# Altium schematic sheet TestPCB_2561.SchDoc: Datalogger
size A4; Date: 12-1-2023; Author: Jesse Wijermars; CompanyName: Blue Racing team; DrawnBy: Jesse Wijermars; Revision: 1; SheetNumber: 1; SheetTotal: 1
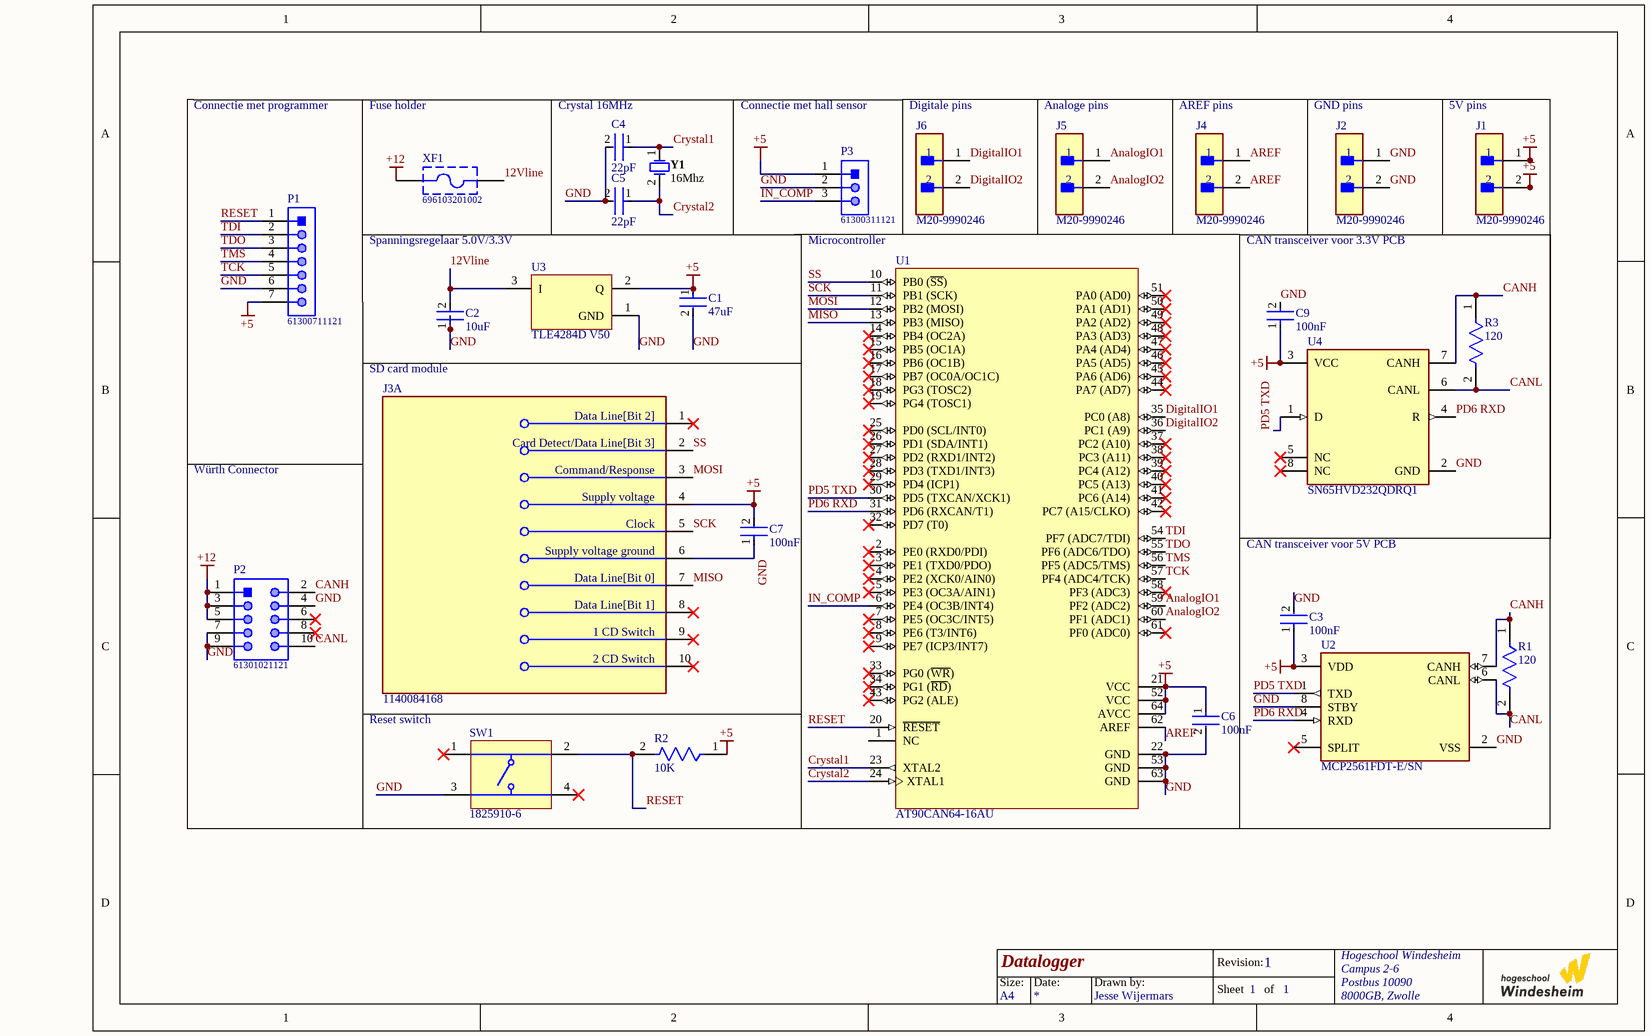
[diagram p0: TestPCB_2561.SchDoc]

## Parts
C1  47uF  [FP-CC1206-1_25-MFG]
C2  10uF  [FP-CC1206-1_25-MFG]
C3  100nF  [FP-CC1206-1_25-MFG]
C4  22pF  [FP-CC1206-1_25-MFG]
C5  22pF  [FP-CC1206-1_25-MFG]
C6  100nF  [FP-CC1206-1_25-MFG]
C7  100nF  [FP-CC1206-1_25-MFG]
C9  100nF  [FP-CC1206-1_25-MFG]
J1  M20-9990246  [FP-M20-9990246-MFG]
J2  M20-9990246  [FP-M20-9990246-MFG]
J3  1140084168  [FP-1140084168-0]  (part A of 2)
J4  M20-9990246  [FP-M20-9990246-MFG]
J5  M20-9990246  [FP-M20-9990246-MFG]
J6  M20-9990246  [FP-M20-9990246-MFG]
P1  61300711121  [61300711121]
P2  61301021121  [61301021121]
P3  61300311121  [61300311121]
R1  120  [FP-CRCW1206-e3-IPC_C]
R2  10K  [FP-CRCW1206-e3-IPC_C]
R3  120  [FP-CRCW1206-e3-IPC_C]
SW1  1825910-6  [TECO-1825910-6_V]
U1  AT90CAN64-16AU  [64A_M]
U2  MCP2561FDT-E/SN  [FP-C04-057-SN-MFG]
U3  TLE4284D V50  [INF-PG-TO252-3-11_M]
U4  SN65HVD232QDRQ1  [FP-D0008A-MFG]
XF1  696103201002  [696103201002]
Y1  16Mhz  [FOX-FOXSLF160-20]

## Nets
+5: C1.1 C3.1 C6.1 C7.2 C9.1 J1.1 J1.2 J3.4(Supply_voltage) P1.7 P3.1 R2.1 U1.21(VCC) U1.52(VCC) U1.64(AVCC) U2.3(VDD) U3.2(Q) U4.3(VCC)
+12: P2.1 P2.3 P2.5 XF1.1
12Vline: C2.2 U3.3(I) XF1.2
AnalogIO1: J5.1 U1.59(PF2_(ADC2))
AnalogIO2: J5.2 U1.60(PF1_(ADC1))
AREF: J4.1 J4.2 U1.62(AREF)
CANH: P2.2 R1.1 R3.1 U2.7(CANH) U4.7(CANH)
CANL: P2.10 R1.2 R3.2 U2.6(CANL) U4.6(CANL)
Crystal1: C4.1 U1.23(XTAL2) Y1.1
Crystal2: C5.1 U1.24(XTAL1) Y1.2
DigitalIO1: J6.1 U1.35(PC0_(A8))
DigitalIO2: J6.2 U1.36(PC1_(A9))
GND: C1.2 C2.1 C3.2 C4.2 C5.2 C6.2 C7.1 C9.2 J2.1 J2.2 J3.6(Supply_voltage_ground) P1.6 P2.4 P2.7 P2.9 P3.2 SW1.3 U1.22(GND) U1.53(GND) U1.63(GND) U2.2(VSS) U2.8(STBY) U3.1(GND) U4.2(GND)
IN_COMP: P3.3 U1.6(PE4_(OC3B/INT4))
MISO: J3.7(Data_Line[Bit_0]) U1.13(PB3_(MISO))
MOSI: J3.3(Command/Response) U1.12(PB2_(MOSI))
PD5 TXD: U1.30(PD5_(TXCAN/XCK1)) U2.1(TXD) U4.1(D)
PD6 RXD: U1.31(PD6_(RXCAN/T1)) U2.4(RXD) U4.4(R)
RESET: P1.1 R2.2 SW1.2 U1.20(~{RESET})
SCK: J3.5(Clock) U1.11(PB1_(SCK))
SS: J3.2(Card_Detect/Data_Line[Bit_3]) U1.10(PB0_(~{SS}))
TCK: P1.5 U1.57(PF4_(ADC4/TCK))
TDI: P1.2 U1.54(PF7_(ADC7/TDI))
TDO: P1.3 U1.55(PF6_(ADC6/TDO))
TMS: P1.4 U1.56(PF5_(ADC5/TMS))

Not connected (* = marked no-connect by the designer): J3 1(Data_Line[Bit_2])* 8(Data_Line[Bit_1])* 9(1_CD_Switch)* 10(2_CD_Switch)*; P2 6* 8*; SW1 1* 4*; U1 1(NC) 2(PE0_(RXD0/PDI))* 3(PE1_(TXD0/PDO))* 4(PE2_(XCK0/AIN0))* 5(PE3_(OC3A/AIN1))* 7(PE5_(OC3C/INT5))* 8(PE6_(T3/INT6))* 9(PE7_(ICP3/INT7))* 14(PB4_(OC2A))* 15(PB5_(OC1A))* 16(PB6_(OC1B))* 17(PB7_(OC0A/OC1C))* 18(PG3_(TOSC2))* 19(PG4_(TOSC1))* 25(PD0_(SCL/INT0))* 26(PD1_(SDA/INT1))* 27(PD2_(RXD1/INT2))* 28(PD3_(TXD1/INT3))* 29(PD4_(ICP1))* 32(PD7_(T0))* 33(PG0_(~{WR}))* 34(PG1_(~{RD}))* 37(PC2_(A10))* 38(PC3_(A11))* 39(PC4_(A12))* 40(PC5_(A13))* 41(PC6_(A14))* 42(PC7_(A15/CLKO))* 43(PG2_(ALE))* 44(PA7_(AD7))* 45(PA6_(AD6))* 46(PA5_(AD5))* 47(PA4_(AD4))* 48(PA3_(AD3))* 49(PA2_(AD2))* 50(PA1_(AD1))* 51(PA0_(AD0))* 58(PF3_(ADC3))* 61(PF0_(ADC0))*; U2 5(SPLIT)*; U4 5(NC)* 8(NC)*

## Notes on the sheet
- Connectie met programmer
- Fuse holder
- Crystal 16MHz
- Connectie met hall sensor
- (near J6) Digitale pins
- (near J5) Analoge pins
- (near J4) AREF pins
- (near J2) GND pins
- (near J1) 5V pins
- Spanningsregelaar 5.0V/3.3V
- Microcontroller
- CAN transceiver voor 3.3V PCB
- (near C2) SD card module
- Würth Connector
- CAN transceiver voor 5V PCB
- (near SW1) Reset switch
- Size:
- Date:
- Drawn by:
- Revision:
- Hogeschool Windesheim
- Campus 2-6
- Postbus 10090
- A4
- Sheet
- of
- 8000GB, Zwolle

## Library data of the parts
C1 C2 C4 C5 = CMP-03422-000842-1: CAP CER 0.1UF 50V X7R 1206; Manufacturer: Yageo; Manufacturer Part Number: CC1206KRX7R9BB104; Automotive Grade: NA; Value: 100 nF; Tolerance: 0.1; Material: Ceramic; Temperature Coefficient: 15%; Temperature Characteristic: X7R; Device Class L1: Passive Components; Lead Free: Yes; Octopart: https://octopart.com/cc1206krx7r9bb104-yageo-39467816; Category: Cap; Temperature Range Low: -55°C; Device Class L3: Ceramic Capacitors; Voltage Rating: 50 V; Temperature Range High: +125°C; Device Class L2: Capacitors; RoHS: TRUE; Package: CC1206-1.25; Footprint Url: http://www.yageo.com/exep/pages/download/literatures/UPY-C_GEN_24.pdf; ComponentLink2Description: Datasheet; Temperature: -55°C to +125°C; Capacitance: 100 nF; Digikey Description: CAP CER 0.1UF 50V X7R 1206; Height: 1.45mm; Automotive: No; Mouser Description: Multilayer Ceramic Capacitors MLCC - SMD/SMT 100nF 50V X7R 10%; ComponentLink2URL: http://www.yageo.com/documents/recent/UPY-NP0X7R_HV_1KV-to-3KV_11.pdf
C3 C6 C7 C9 = CMP-03422-000842-1: CAP CER 0.1UF 50V X7R 1206; Manufacturer: Yageo; Manufacturer Part Number: CC1206KRX7R9BB104; Automotive Grade: NA; Tolerance: 0.1; Material: Ceramic; Temperature Coefficient: 15%; Temperature Characteristic: X7R; Device Class L1: Passive Components; Lead Free: Yes; Octopart: https://octopart.com/cc1206krx7r9bb104-yageo-39467816; Category: Cap; Value: 100 nF; Temperature Range Low: -55°C; Device Class L3: Ceramic Capacitors; Voltage Rating: 50 V; Temperature Range High: +125°C; Device Class L2: Capacitors; RoHS: TRUE; Package: CC1206-1.25; Footprint Url: http://www.yageo.com/exep/pages/download/literatures/UPY-C_GEN_24.pdf; ComponentLink2Description: Datasheet; Temperature: -55°C to +125°C; Capacitance: 100 nF; Digikey Description: CAP CER 0.1UF 50V X7R 1206; Height: 1.45mm; Automotive: No; Mouser Description: Multilayer Ceramic Capacitors MLCC - SMD/SMT 100nF 50V X7R 10%; ComponentLink2URL: http://www.yageo.com/documents/recent/UPY-NP0X7R_HV_1KV-to-3KV_11.pdf
J1 J2 J4-J6 = CMP-15831-000009-1: CONN HEADER VERT 2POS 2.54MM; Manufacturer: Harwin; Conn Gender: Male; Conn Orientation: Vertical; Number Of Contacts: 2; Current Rating: 3A; ComponentLink2URL: https://cdn.harwin.com/pdfs/M20-999.pdf; ComponentLink2Description: Datasheet; Package: M20-9990246; Temperature: -40°C to +105°C; Octopart: https://octopart.com/m20-9990246-harwin-2590635; Mouser Description: 2.54mm (0.1") Pitch SIL Vertical PC Tail Pin Header, 6.1mm mating pin height, tin, 2 contacts; Temperature Range High: +105°C; Device Class L1: Connectors; RoHS: TRUE; Automotive: No; Height: 8.99mm; Number Of Rows: 1; Contact Material: Tin,Nickel; Category: Conn; Pitch: 2.54mm; Lead Free: Yes; Digikey Description: CONN HEADER VERT 2POS 2.54MM; Manufacturer Part Number: M20-9990246; Temperature Range Low: -40°C; Device Class L3: unset; Device Class L2: Headers and Wire Housings
J3 = CMP-02360-000003-1: CONN MICRO SD CARD PUSH-PULL R/A; Gender: Receptacle; Number of Contacts: 8; Connector Type: Connector; Pitch: 1.1mm; Lead Free: Lead Free; Housing Material: Polymer; Radiation Hardening: No; Mount: Surface Mount; Depth: 11.45mm; Number of Rows: 1; Height: 1.55mm; Contact Plating: Gold; Package Quantity: 7500; Packaging: Tape and Reel; Termination: SMD/SMT; Length: 15.6mm; Orientation: Right Angle; Flammability Rating: UL94 V-0; Contact Material: Copper Alloy
P1 = CMP-1502-01074-1: THT Vertical Pin Header WR-PHD, Pitch 2.54 mm, Single Row, 7 pins; Manufacturer: Wurth Elektronik; Pin Number: 7; Gender: Male; Working Voltage: 250VAC; Contact Resistance: 20mOhm; Rated Current: 3A; Pitch: 2.54mm; Withstanding Voltage: 500VAC; Row Number: Single; Packaging: Bag; Orientation: Vertical; Manufacturer URL: http://www.we-online.de; Datasheet URL: https://katalog.we-online.de/em/datasheet/6130xx11121.pdf; Part Number: 61300711121; Publisher: WurthElektronik; Operating Temperature: -40to105degC; Mounting Technology: THT; Package Reference: 61300711121
P2 = CMP-1502-01084-1: THT Vertical Pin Header WR-PHD, Pitch 2.54 mm, Dual Row, 10 pins; Manufacturer: Wurth Elektronik; Working Voltage: 250VAC; Pitch: 2.54mm; Contact Resistance: 20mOhm; Gender: Male; Rated Current: 3A; Withstanding Voltage: 500VAC; Pin Number: 10; Operating Temperature: -40to105degC; Mounting Technology: THT; Publisher: WurthElektronik; Manufacturer URL: http://www.we-online.de; Part Number: 61301021121; Row Number: Dual; Packaging: Bag; Orientation: Vertical; Package Reference: 61301021121; Datasheet URL: https://katalog.we-online.de/em/datasheet/6130xx21121.pdf
P3 = CMP-1502-01062-1: THT Vertical Pin Header WR-PHD, Pitch 2.54 mm, Single Row, 3 pins; Manufacturer: Wurth Elektronik; Withstanding Voltage: 500VAC; Working Voltage: 250VAC; Rated Current: 3A; Pitch: 2.54mm; Pin Number: 3; Gender: Male; Contact Resistance: 20mOhm; Package Reference: 61300311121; Manufacturer URL: http://www.we-online.de; Datasheet URL: https://katalog.we-online.de/em/datasheet/6130xx11121.pdf; Operating Temperature: -40to105degC; Part Number: 61300311121; Orientation: Vertical; Packaging: Bag; Row Number: Single; Mounting Technology: THT; Publisher: WurthElektronik
R1-R3 = CMP-2003-04857-2: RES Thick Film, 0Ω, 0.25W, 1206; Resistance: 0mR; Power Rating: 250mW; Temperature Coefficient: 100ppm/°C; Tolerance: 1%; Voltage Rating (DC): 200V; Width: 1.6mm; Termination: SMD/SMT; Contact Plating: Tin; Min Operating Temperature: -55°C; Military Standard: Not; Mount: Surface Mount; Case Code (Metric): 3216; Case Code (Imperial): 1206; Packaging: Tape and Reel; Depth: 1.6mm; Case/Package: 1206; Radiation Hardening: No; Height: 0.55mm; Package Quantity: 5000; Weight: 0.000353oz; Max Operating Temperature: 155°C; Length: 3.2mm; Composition: Thick Film; Lead Free: Lead Free; Voltage Rating: 200V
SW1 = CMP-1684-00021-1: Tact Switch, SPST-NO, 0.05 A, -35 to 85 degC, 4-Pin THD, RoHS, Bulk; Manufacturer: TE Connectivity; Maximum Contact Resistance: 100mOhm; Mechanical Life: 100000Cycles; Bushing Type: Unthreaded; Switch Configuration: OFF(ON); Maximum DC Voltage Rating: 24V; Contact Rating @ Voltage: 0.05A@24VDC; Actuator Color: Black; Body Orientation: Straight; Function: MomentaryContact; Illumination: N/R; Actuator Style: RoundButton; Actuator Material: PolybutyleneTerephthalate; Dielectric Strength: 500VAC; Pole Throw Configuration: SPST; Actuator Length: 1.4mm; Product Weight: N/A; Contact Material: CopperAlloy; Housing Material: N/A; Terminal Type: PCPins; Minimum Insulation Resistance: 100MOhm; Package Description: 4-Pin Through Hole Device, Body 5.99 x 5.99 mm, Pitch 6.5 mm; Part No: 1825910-6; Package Reference: THD; Base Material: N/A; Manufacturer URL: http://www.te.com; Contact Plating: Silver; RoHS: Yes; Datasheet Version: Rev. C9; Electrical Life: 100000Cycles; Maximum AC Voltage Rating: N/A; Thread Size: N/R; Operating Temperature: -35to85C; Mounting: ThroughHole; Dimension: 5.99x5mm; Datasheet URL: http://www.te.com/commerce/DocumentDelivery/DDEController?Action=showdoc&DocId=Customer+Drawing%7F1825910%7FC9%7Fpdf%7FEnglish%7FENG_CD_1825910_C9.pdf%7F1825910-6; Family: 1825910; Seal Location: N/A; Seal Description: N/A; Packaging: N/A
U1 = CMP-0096-00123-2: 8-bit AVR Microcontroller, 64KB Flash and CAN Controller, 53 GPIO pins, Industrial Grade (-40° to +85°C), 64-pin LQFP, Green; ComponentLink3Description: AT90CAN32/64/128 Summary; ComponentLink2Description: AT90CAN32/64/128 Datasheet; ComponentLink3URL: http://www.atmel.com/dyn/resources/prod_documents/7679S.pdf; ComponentLink1Description: Manufacturer URL; Code_JEDEC: MS-026-AEB; ComponentLink2URL: http://www.atmel.com/dyn/resources/prod_documents/doc7679.pdf; PackageReference: 64A; DatasheetVersion: revH, Aug-2008; ComponentLink1URL: http://www.atmel.com/; PackageVersion: revC, Oct-2010; PackageDescription: 64-Pin Plastic Thin Profile Quad Flat Pack, 14 x 14 x 1.0 mm Body, 0.8 mm Pitch (TQFP); RevisionNote: PackageVersion updated. URLs added.
U2 = CMP-06279-000064-1: IC TRANSCEIVER 1/1 8SOIC; Data Rate: 8Mbps; Operating Supply Current: 70mA; Max Supply Voltage: 5.5V; Number of Transceivers: 1; Receiver Hysteresis: 200mV; Min Supply Voltage: 4.5V; Case/Package: SOIC; Mount: Surface Mount; Weight: 0.019048oz; Min Operating Temperature: -40°C; Package Quantity: 3300; Series: -; Packaging: Tape and Reel; Max Operating Temperature: 125°C; RoHS Compliant: Yes; Number of Pins: 8
U3 = CMP-1109-00133-1: Voltage Regulator, 6.4 to 40 V Supply, 5 V Output, -40 to 150 degC, PG-TO252-3-11, Reel, Green; Manufacturer: Infineon; Accuracy: 3 %; Typical Quiescent Current: 800 uA; Output Voltage: 5V; Dropout Voltage: 1300 mV; Max. Output Current: 1000 mA; Green: TRUE; Regulator Type: single output; ComponentLink2Description: Datasheet; PartNumber: TLE4284D V50; Mounting Technology: Surface Mount; ComponentLink2URL: http://www.infineon.com/dgdl/TLE4284_DS_21.pdf?folderId=db3a304318f3fe290118f5a433570040&fileId=db3a30431c48a312011c51ca22f501de&location=en.Products.Automotive_ICs.Linear_Voltage_Regulators_for_Automotive-Applications.Linear_Voltage_Regulators_-_Selection; Halogen-free: TRUE; DatasheetVersion: Rev. 2.1; ComponentLink1Description: Manufacturer URL; ComponentLink3Description: Package Specification; PackageVersion: Dec-06; PackageDescription: 3-Pin Plastic (Green) Transistor Single Outline Package, 6.5 x 6.12 mm Body, 2.28 mm Pitch; Operating Range: 6.4 to 40 V; Packing: Reel; PackageReference: PG-TO252-3-11; ComponentLink1URL: http://www.infineon.com/; ComponentLink3URL: http://www.infineon.com/dgdl/BTS142_DS_13.pdf?folderId=db3a3043163797a6011667aa084c0e01&fileId=db3a3043163797a6011667ac98be0e02&location=en.Products.Automotive_ICs.Smart_High-_and_Low-Side_Switches.HITFET___TEMPFET__-_Smart_Low-Side_Switches.DATASHEET.BTS1
U4 = CMP-04872-000052-1: IC TRANSCEIVER HALF 1/1 8SOIC; Max Supply Current: 17mA; Data Rate: 1Mbps; Number of Receive Buffers: 1; Max Supply Voltage: 3.6V; Operating Supply Voltage: 3.3V; Interface: CAN; Min Supply Voltage: 3V; Contact Plating: Gold; Case/Package: SOIC; Mount: Surface Mount; Number of Transceivers: 1; Number of Drivers: 1; Package Quantity: 2500; Number of Pins: 8; REACH SVHC: No SVHC; RoHS Compliant: Yes; Series: -; Supply Current: 17mA; Radiation Hardening: No; Nominal Supply Current: 17mA; Lead Free: Lead Free; Number of Transmit Buffers: 1; Max Operating Temperature: 125°C; Packaging: Tape and Reel; Weight: 0.002822oz; Min Operating Temperature: -40°C
XF1 = CMP-1502-00239-1: WR-FSH Fuse Holder Blocks Fuse Holder Blocks Clip Cover for PCB - THR Version; Manufacturer: Wurth Elektronik; Fuse Size: 5x20mm; Package Reference: 696103201002; Operating Temperature: -30to120degC; Part Number: 696103201002; Packaging: Box; Datasheet URL: https://katalog.we-online.de/em/datasheet/696103201002.pdf; Publisher: WurthElektronik; Mounting Technology: THR; Manufacturer URL: http://www.we-online.de
Y1 = CMP-1749-00003-1: Resistance Weld Thru-Hole Crystal, 16 MHz, -20 to 70 degC, 2-Pin THD, RoHS, Bulk; Voltage Rating: 250 V; Tolerance: 1%; Resistance: 221 kohm; Case\Package: Axial; Power Rating: 250 mW; RoHSCompliant: true; Package Quantity: 200; Packaging: Bulk; Min Operating Temperature: -55 degC; DatasheetVersion: Mar-15; ComponentLink1URL: http://www.foxonline.com/; Max Operating Temperature: 155 degC; PackageReference: FOXSLF160-20; Mount: Through Hole; PackageDescription: 2-Pin Through Hole Device, Body 11.35 x 4.65 mm; ComponentLink1Description: Manufacturer URL; ComponentLink2URL: http://www.foxonline.com/pdfs/hc49slf.pdf; ComponentLink2Description: Datasheet; Length: 0.248 inch